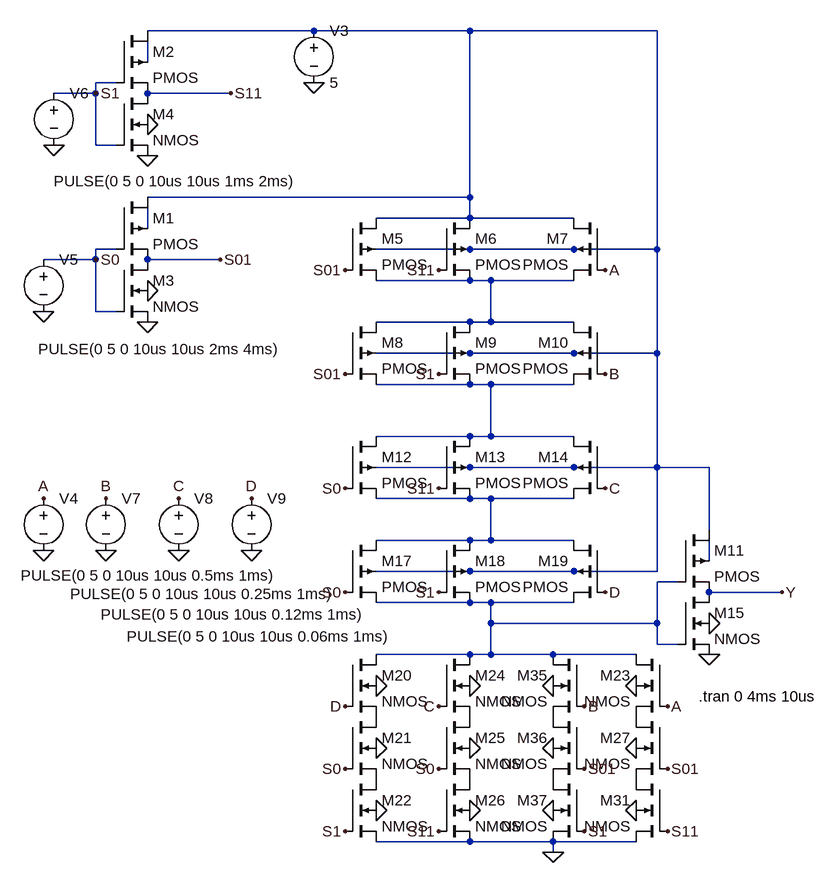
[diagram p0: schematic mux421statcmos.asc]
mux421statcmos.asc, the LTspice schematic file:
Version 4
SHEET 1 2140 1632
WIRE 656 -128 400 -128
WIRE 896 -128 656 -128
WIRE 1184 -128 896 -128
WIRE 400 -80 400 -112
WIRE 352 -48 320 -48
WIRE 320 -32 320 -48
WIRE 320 -32 256 -32
WIRE 528 -32 400 -32
WIRE 320 48 320 -32
WIRE 352 48 320 48
WIRE 896 128 896 -128
WIRE 896 128 400 128
WIRE 896 160 896 128
WIRE 896 160 752 160
WIRE 1056 160 896 160
WIRE 400 176 400 144
WIRE 352 208 320 208
WIRE 896 208 752 208
WIRE 1056 208 896 208
WIRE 1184 208 1184 -128
WIRE 1184 208 1056 208
WIRE 320 224 320 208
WIRE 320 224 240 224
WIRE 512 224 400 224
WIRE 896 256 752 256
WIRE 928 256 896 256
WIRE 1056 256 928 256
WIRE 320 304 320 224
WIRE 352 304 320 304
WIRE 896 320 752 320
WIRE 928 320 928 256
WIRE 928 320 896 320
WIRE 1056 320 928 320
WIRE 896 368 752 368
WIRE 1056 368 896 368
WIRE 1184 368 1184 208
WIRE 1184 368 1056 368
WIRE 896 416 752 416
WIRE 928 416 896 416
WIRE 1056 416 928 416
WIRE 896 496 752 496
WIRE 928 496 928 416
WIRE 928 496 896 496
WIRE 1056 496 928 496
WIRE 896 544 752 544
WIRE 1056 544 896 544
WIRE 1184 544 1184 368
WIRE 1184 544 1056 544
WIRE 1264 544 1184 544
WIRE 896 592 752 592
WIRE 928 592 896 592
WIRE 1056 592 928 592
WIRE 1264 640 1264 544
WIRE 896 656 752 656
WIRE 928 656 928 592
WIRE 928 656 896 656
WIRE 1056 656 928 656
WIRE 1264 688 1264 656
WIRE 896 704 752 704
WIRE 1056 704 896 704
WIRE 1184 704 1184 544
WIRE 1184 704 1056 704
WIRE 1216 720 1184 720
WIRE 1376 736 1264 736
WIRE 896 752 752 752
WIRE 928 752 896 752
WIRE 1056 752 928 752
WIRE 928 784 928 752
WIRE 1184 784 1184 720
WIRE 1184 784 928 784
WIRE 1184 816 1184 784
WIRE 1216 816 1184 816
WIRE 896 832 752 832
WIRE 928 832 928 784
WIRE 928 832 896 832
WIRE 1024 832 928 832
WIRE 1152 832 1024 832
WIRE 896 1120 752 1120
WIRE 1024 1120 896 1120
WIRE 1152 1120 1024 1120
WIRE 1024 1136 1024 1120
FLAG 400 320 0
FLAG 400 64 0
FLAG 400 16 0
FLAG 400 272 0
FLAG 320 224 S0
FLAG 320 -32 S1
FLAG 1024 1136 0
FLAG 1264 832 0
FLAG 1264 784 0
FLAG 752 1072 0
FLAG 752 976 0
FLAG 752 880 0
FLAG 896 880 0
FLAG 896 976 0
FLAG 896 1072 0
FLAG 1024 1072 0
FLAG 1024 976 0
FLAG 1024 880 0
FLAG 1152 880 0
FLAG 1152 976 0
FLAG 1152 1072 0
FLAG 512 224 S01
FLAG 528 -32 S11
FLAG 1104 240 A
FLAG 1200 912 A
FLAG 1072 912 B
FLAG 1104 400 B
FLAG 1104 576 C
FLAG 848 912 C
FLAG 1104 736 D
FLAG 704 912 D
FLAG 704 240 S01
FLAG 704 400 S01
FLAG 1200 1008 S01
FLAG 1072 1008 S01
FLAG 848 240 S11
FLAG 848 576 S11
FLAG 1200 1104 S11
FLAG 848 1104 S11
FLAG 704 576 S0
FLAG 704 736 S0
FLAG 848 1008 S0
FLAG 848 400 S1
FLAG 848 736 S1
FLAG 1072 1104 S1
FLAG 704 1008 S0
FLAG 704 1104 S1
FLAG 656 -48 0
FLAG 240 304 0
FLAG 256 48 0
FLAG 240 672 0
FLAG 336 672 0
FLAG 448 672 0
FLAG 560 672 0
FLAG 240 592 A
FLAG 336 592 B
FLAG 448 592 C
FLAG 560 592 D
FLAG 1376 736 Y
SYMBOL pmos4 352 128 R0
SYMATTR InstName M1
SYMBOL pmos4 352 -128 R0
SYMATTR InstName M2
SYMBOL nmos4 352 224 R0
SYMATTR InstName M3
SYMBOL nmos4 352 -32 R0
SYMATTR InstName M4
SYMBOL pmos4 704 160 R0
SYMATTR InstName M5
SYMBOL pmos4 848 160 R0
SYMATTR InstName M6
SYMBOL pmos4 1104 160 M0
SYMATTR InstName M7
SYMBOL pmos4 704 320 R0
SYMATTR InstName M8
SYMBOL pmos4 848 320 R0
SYMATTR InstName M9
SYMBOL pmos4 1104 320 M0
SYMATTR InstName M10
SYMBOL pmos4 704 496 R0
SYMATTR InstName M12
SYMBOL pmos4 848 496 R0
SYMATTR InstName M13
SYMBOL pmos4 1104 496 M0
SYMATTR InstName M14
SYMBOL pmos4 704 656 R0
SYMATTR InstName M17
SYMBOL pmos4 848 656 R0
SYMATTR InstName M18
SYMBOL pmos4 1104 656 M0
SYMATTR InstName M19
SYMBOL nmos4 704 832 R0
SYMATTR InstName M20
SYMBOL nmos4 704 928 R0
SYMATTR InstName M21
SYMBOL nmos4 704 1024 R0
SYMATTR InstName M22
SYMBOL nmos4 848 832 R0
SYMATTR InstName M24
SYMBOL nmos4 848 928 R0
SYMATTR InstName M25
SYMBOL nmos4 848 1024 R0
SYMATTR InstName M26
SYMBOL nmos4 1200 832 M0
SYMATTR InstName M23
SYMBOL nmos4 1200 928 M0
SYMATTR InstName M27
SYMBOL nmos4 1200 1024 M0
SYMATTR InstName M31
SYMBOL nmos4 1072 832 M0
SYMATTR InstName M35
SYMBOL nmos4 1072 928 M0
SYMATTR InstName M36
SYMBOL nmos4 1072 1024 M0
SYMATTR InstName M37
SYMBOL pmos4 1216 640 R0
SYMATTR InstName M11
SYMBOL nmos4 1216 736 R0
SYMATTR InstName M15
SYMBOL voltage 656 -144 R0
WINDOW 123 0 0 Left 2
WINDOW 39 0 0 Left 2
SYMATTR InstName V3
SYMATTR Value 5
SYMBOL voltage 240 208 R0
WINDOW 123 0 0 Left 2
WINDOW 39 0 0 Left 2
WINDOW 3 -8 154 Left 2
SYMATTR InstName V5
SYMATTR Value PULSE(0 5 0 10us 10us 2ms 4ms)
SYMBOL voltage 256 -48 R0
WINDOW 123 0 0 Left 2
WINDOW 39 0 0 Left 2
WINDOW 3 0 151 Left 2
SYMATTR InstName V6
SYMATTR Value PULSE(0 5 0 10us 10us 1ms 2ms)
SYMBOL voltage 240 576 R0
WINDOW 3 -35 134 Left 2
WINDOW 123 0 0 Left 2
WINDOW 39 0 0 Left 2
SYMATTR Value PULSE(0 5 0 10us 10us 0.5ms 1ms)
SYMATTR InstName V4
SYMBOL voltage 336 576 R0
WINDOW 123 0 0 Left 2
WINDOW 39 0 0 Left 2
WINDOW 3 -55 163 Left 2
SYMATTR Value PULSE(0 5 0 10us 10us 0.25ms 1ms)
SYMATTR InstName V7
SYMBOL voltage 448 576 R0
WINDOW 123 0 0 Left 2
WINDOW 39 0 0 Left 2
WINDOW 3 -120 194 Left 2
SYMATTR Value PULSE(0 5 0 10us 10us 0.12ms 1ms)
SYMATTR InstName V8
SYMBOL voltage 560 576 R0
WINDOW 123 0 0 Left 2
WINDOW 39 0 0 Left 2
WINDOW 3 -192 228 Left 2
SYMATTR Value PULSE(0 5 0 10us 10us 0.06ms 1ms)
SYMATTR InstName V9
TEXT 1248 896 Left 2 !.tran 0 4ms 10us

The netlist it stands for:
* mux421statcmos.asc
M1 N001 S0 S01 N003 PMOS
M2 N001 S1 S11 N002 PMOS
M3 S01 S0 0 0 NMOS
M4 S11 S1 0 0 NMOS
M5 N001 S01 N004 N001 PMOS
M6 N001 S11 N004 N001 PMOS
M7 N001 A N004 N001 PMOS
M8 N004 S01 N005 N001 PMOS
M9 N004 S1 N005 N001 PMOS
M10 N004 B N005 N001 PMOS
M12 N005 S0 N006 N001 PMOS
M13 N005 S11 N006 N001 PMOS
M14 N005 C N006 N001 PMOS
M17 N006 S0 N008 N001 PMOS
M18 N006 S1 N008 N001 PMOS
M19 N006 D N008 N001 PMOS
M20 N008 D P001 0 NMOS
M21 P001 S0 P002 0 NMOS
M22 P002 S1 0 0 NMOS
M24 N008 C P003 0 NMOS
M25 P003 S0 P004 0 NMOS
M26 P004 S11 0 0 NMOS
M23 N008 A P005 0 NMOS
M27 P005 S01 P006 0 NMOS
M31 P006 S11 0 0 NMOS
M35 N008 B P007 0 NMOS
M36 P007 S01 P008 0 NMOS
M37 P008 S1 0 0 NMOS
M11 N001 N008 Y N007 PMOS
M15 Y N008 0 0 NMOS
V3 N001 0 5
V5 S0 0 PULSE(0 5 0 10us 10us 2ms 4ms)
V6 S1 0 PULSE(0 5 0 10us 10us 1ms 2ms)
V4 A 0 PULSE(0 5 0 10us 10us 0.5ms 1ms)
V7 B 0 PULSE(0 5 0 10us 10us 0.25ms 1ms)
V8 C 0 PULSE(0 5 0 10us 10us 0.12ms 1ms)
V9 D 0 PULSE(0 5 0 10us 10us 0.06ms 1ms)
.model NMOS NMOS
.model PMOS PMOS
.lib standard.mos
.tran 0 4ms 10us
.backanno
.end